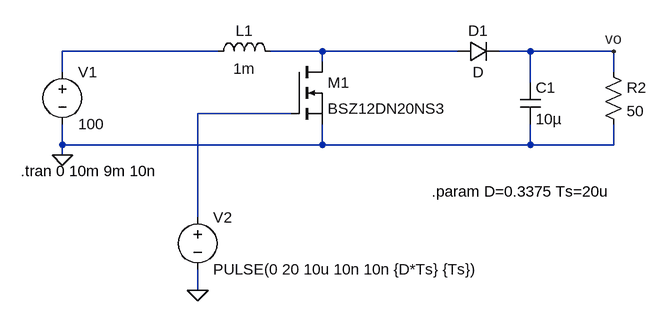
[diagram p0: schematic boost.asc]
boost.asc, the LTspice schematic file:
Version 4
SHEET 1 1176 680
WIRE 288 48 48 48
WIRE 448 48 368 48
WIRE 656 48 448 48
WIRE 768 48 720 48
WIRE 896 48 768 48
WIRE 448 64 448 48
WIRE 48 80 48 48
WIRE 896 80 896 48
WIRE 768 96 768 48
WIRE 400 144 256 144
WIRE 48 192 48 160
WIRE 448 192 448 160
WIRE 448 192 48 192
WIRE 768 192 768 160
WIRE 768 192 448 192
WIRE 896 192 896 160
WIRE 896 192 768 192
WIRE 48 208 48 192
WIRE 256 304 256 144
WIRE 256 416 256 384
FLAG 48 208 0
FLAG 256 416 0
FLAG 896 48 vo
SYMBOL voltage 48 64 R0
WINDOW 123 0 0 Left 0
WINDOW 39 0 0 Left 0
SYMATTR InstName V1
SYMATTR Value 100
SYMBOL nmos 400 64 R0
SYMATTR InstName M1
SYMATTR Value BSZ12DN20NS3
SYMBOL voltage 256 288 R0
WINDOW 123 0 0 Left 0
WINDOW 39 0 0 Left 0
SYMATTR InstName V2
SYMATTR Value PULSE(0 20 10u 10n 10n {D*Ts} {Ts})
SYMBOL ind 272 64 R270
WINDOW 0 32 56 VTop 2
WINDOW 3 5 56 VBottom 2
SYMATTR InstName L1
SYMATTR Value 1m
SYMBOL diode 656 64 R270
WINDOW 0 32 32 VTop 2
WINDOW 3 0 32 VBottom 2
SYMATTR InstName D1
SYMBOL cap 752 96 R0
SYMATTR InstName C1
SYMATTR Value 10µ
SYMATTR SpiceLine Rser=0.01
SYMBOL res 880 64 R0
SYMATTR InstName R2
SYMATTR Value 50
TEXT -16 232 Left 2 !.tran 0 10m 9m 10n
TEXT 616 264 Left 2 !.param D=0.3375 Ts=20u

The netlist it stands for:
* boost.asc
V1 N001 0 100
M1 N002 N003 0 0 BSZ12DN20NS3
V2 N003 0 PULSE(0 20 10u 10n 10n {D*Ts} {Ts})
L1 N001 N002 1m
D1 N002 vo D
C1 vo 0 10µ Rser=0.01
R2 vo 0 50
.model D D
.lib standard.dio
.model NMOS NMOS
.model PMOS PMOS
.lib standard.mos
.tran 0 10m 9m 10n
.param D=0.3375 Ts=20u
.backanno
.end